# Altium schematic sheet UserInterface_0.SchDoc: FPGA POETIC
size A2; Date: Date; Author: Jean Nanchen; CompanyName: HESSO; Engineer: Name; Address1: Route du Rawyl 47; Address2: 1950 Sion; Address3: Switzerland; Revision: 1.0; SchematicDesigner: Jean Nanchen; SchematicRevision: 1.0; SchematicDate: 02.06.2021; CurrentTime: 15:18; CurrentDate: 02.06.2021; ProjectName: Project Name
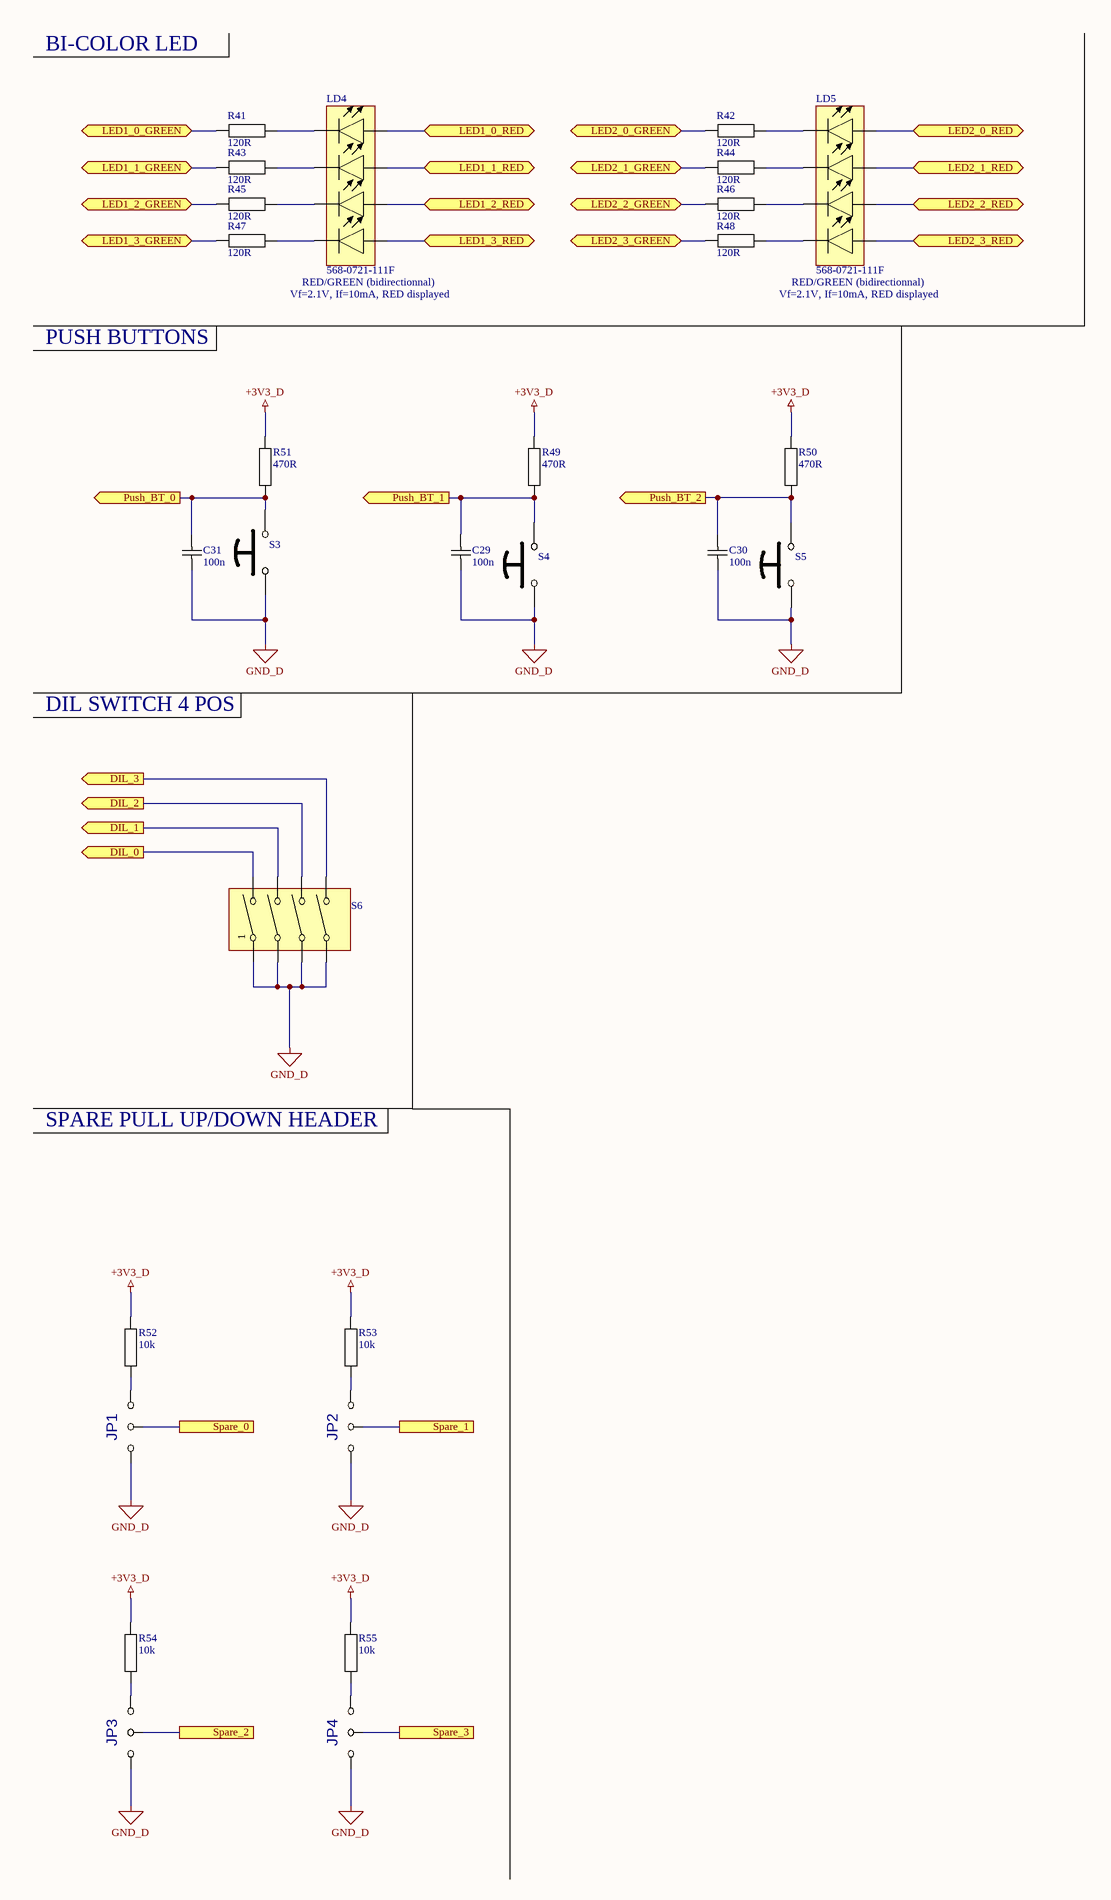
[diagram p0: UserInterface_0.SchDoc, left]
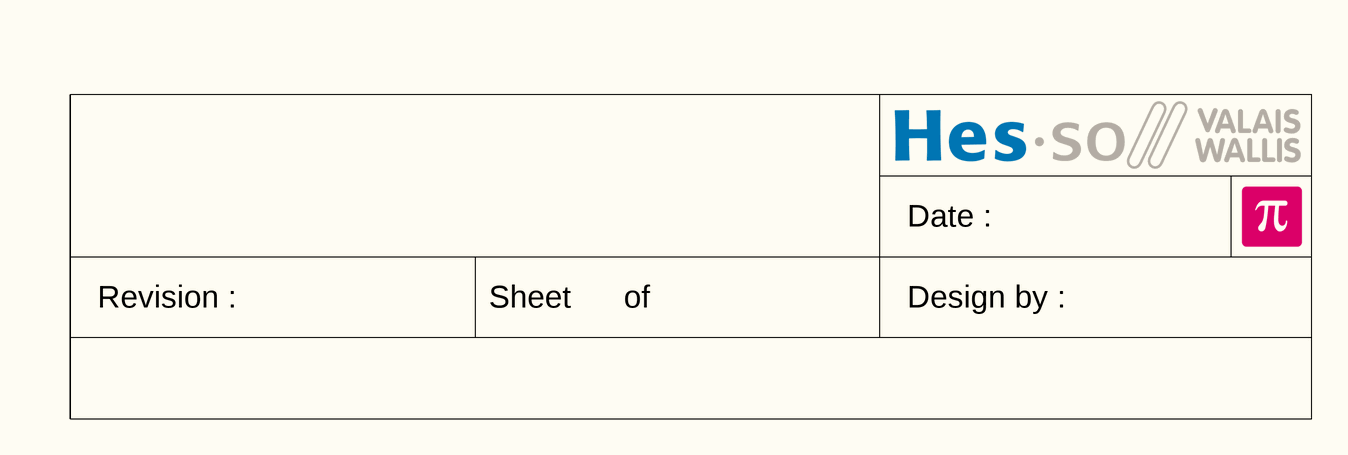
[diagram p1: UserInterface_0.SchDoc, right]

## Parts
C29  100n  [CAPACITOR 1608 REFLOW]
C30  100n  [CAPACITOR 1608 REFLOW]
C31  100n  [CAPACITOR 1608 REFLOW]
JP1  {Value}  [JUMPER3 SMD 2012]  (value not drawn)
JP2  {Value}  [JUMPER3 SMD 2012]  (value not drawn)
JP3  {Value}  [JUMPER3 SMD 2012]  (value not drawn)
JP4  {Value}  [JUMPER3 SMD 2012]  (value not drawn)
LD4  568-0721-111F  [LED Dialight 568-0721-111]
LD5  568-0721-111F  [LED Dialight 568-0721-111]
R41  120R  [RESISTOR 1608 REFLOW]
R42  120R  [RESISTOR 1608 REFLOW]
R43  120R  [RESISTOR 1608 REFLOW]
R44  120R  [RESISTOR 1608 REFLOW]
R45  120R  [RESISTOR 1608 REFLOW]
R46  120R  [RESISTOR 1608 REFLOW]
R47  120R  [RESISTOR 1608 REFLOW]
R48  120R  [RESISTOR 1608 REFLOW]
R49  470R  [RESISTOR 1608 REFLOW]
R50  470R  [RESISTOR 1608 REFLOW]
R51  470R  [RESISTOR 1608 REFLOW]
R52  10k  [RESISTOR 1608 REFLOW]
R53  10k  [RESISTOR 1608 REFLOW]
R54  10k  [RESISTOR 1608 REFLOW]
R55  10k  [RESISTOR 1608 REFLOW]
S3  FSMRA4JH04  [Push Button C7.1x3.7 TE FSMRA4JH]  (value not drawn)
S4  FSMRA4JH04  [Push Button C7.1x3.7 TE FSMRA4JH]  (value not drawn)
S5  FSMRA4JH04  [Push Button C7.1x3.7 TE FSMRA4JH]  (value not drawn)
S6  *  [DIP SWITCH MULTICOMP  MCDHN-04F]  (value not drawn)

## Ports
DIL_0 (out), DIL_1 (out), DIL_2 (out), DIL_3 (out), LED1_0_GREEN (bidir), LED1_0_RED (bidir), LED1_1_GREEN (bidir), LED1_1_RED (bidir), LED1_2_GREEN (bidir), LED1_2_RED (bidir), LED1_3_GREEN (bidir), LED1_3_RED (bidir), LED2_0_GREEN (bidir), LED2_0_RED (bidir), LED2_1_GREEN (bidir), LED2_1_RED (bidir), LED2_2_GREEN (bidir), LED2_2_RED (bidir), LED2_3_GREEN (bidir), LED2_3_RED (bidir), Push_BT_0 (out), Push_BT_1 (out), Push_BT_2 (out), Spare_0, Spare_1, Spare_2, Spare_3

## Nets
+3V3_D: R49.2 R50.2 R51.2 R52.2 R53.2 R54.2 R55.2
GND_D: C29.1 C30.1 C31.1 JP1.1 JP2.1 JP3.1 JP4.1 S3.1 S4.1 S5.1 S6.1 S6.3 S6.5 S6.7
DIL_0: S6.2 ; port DIL_0
DIL_1: S6.4 ; port DIL_1
DIL_2: S6.6 ; port DIL_2
DIL_3: S6.8 ; port DIL_3
LED1_0_GREEN: R41.1 ; port LED1_0_GREEN
LED1_0_RED: LD4.8(A) ; port LED1_0_RED
LED1_1_GREEN: R43.1 ; port LED1_1_GREEN
LED1_1_RED: LD4.6(A) ; port LED1_1_RED
LED1_2_GREEN: R45.1 ; port LED1_2_GREEN
LED1_2_RED: LD4.4(A) ; port LED1_2_RED
LED1_3_GREEN: R47.1 ; port LED1_3_GREEN
LED1_3_RED: LD4.2(A) ; port LED1_3_RED
LED2_0_GREEN: R42.1 ; port LED2_0_GREEN
LED2_0_RED: LD5.8(A) ; port LED2_0_RED
LED2_1_GREEN: R44.1 ; port LED2_1_GREEN
LED2_1_RED: LD5.6(A) ; port LED2_1_RED
LED2_2_GREEN: R46.1 ; port LED2_2_GREEN
LED2_2_RED: LD5.4(A) ; port LED2_2_RED
LED2_3_GREEN: R48.1 ; port LED2_3_GREEN
LED2_3_RED: LD5.2(A) ; port LED2_3_RED
Push_BT_0: C31.2 R51.1 S3.2 ; port Push_BT_0
Push_BT_1: C29.2 R49.1 S4.2 ; port Push_BT_1
Push_BT_2: C30.2 R50.1 S5.2 ; port Push_BT_2
Spare_0: JP1.2 ; port Spare_0
Spare_1: JP2.2 ; port Spare_1
Spare_2: JP3.2 ; port Spare_2
Spare_3: JP4.2 ; port Spare_3
NetJP1_3: JP1.3 R52.1
NetJP2_3: JP2.3 R53.1
NetJP3_3: JP3.3 R54.1
NetJP4_3: JP4.3 R55.1
NetLD4_1: LD4.1(C) R47.2
NetLD4_3: LD4.3(C) R45.2
NetLD4_5: LD4.5(C) R43.2
NetLD4_7: LD4.7(C) R41.2
NetLD5_1: LD5.1(C) R48.2
NetLD5_3: LD5.3(C) R46.2
NetLD5_5: LD5.5(C) R44.2
NetLD5_7: LD5.7(C) R42.2

## Notes on the sheet
- BI-COLOR LED
- RED/GREEN (bidirectionnal)
- PUSH BUTTONS
- Vf=2.1V, If=10mA, RED displayed
- DIL SWITCH 4 POS
- SPARE PULL UP/DOWN HEADER
- Date :
- Revision :
- Sheet
- of
- Design by :

## Library data of the parts
C29-C31 = Capacitor: Capacitor X7R 10% 50V 2012(0805); Value: 100n
JP1-JP4 = JUMPER 3 POS: Value: {Value}
LD4 LD5 = LED Dialight 568-0721-111F: Value: 568-0721-111F; Manufacturer: Dialight; Mouser No.: 645-568-0721-111F
R41-R48 = Resistor: Resistor 1% 50V 100mW 1608(0603); Value: 120R
R49-R55 = Resistor: Resistor 1% 50V 125mW 2012(0805)
  R49-R51: Value: 470R
  R52-R55: Value: 10k
S3-S5 = Push Button 2Pins: Push Button, 2 pins; Manufacturer: TE Connectivity / Alcoswitch; Value: FSMRA4JH04; Mouser No.: 506-FSMRA4JH04
S6 = DIP Switch 4Pos: MULTICOMP  MCDHN-04F; Value: *